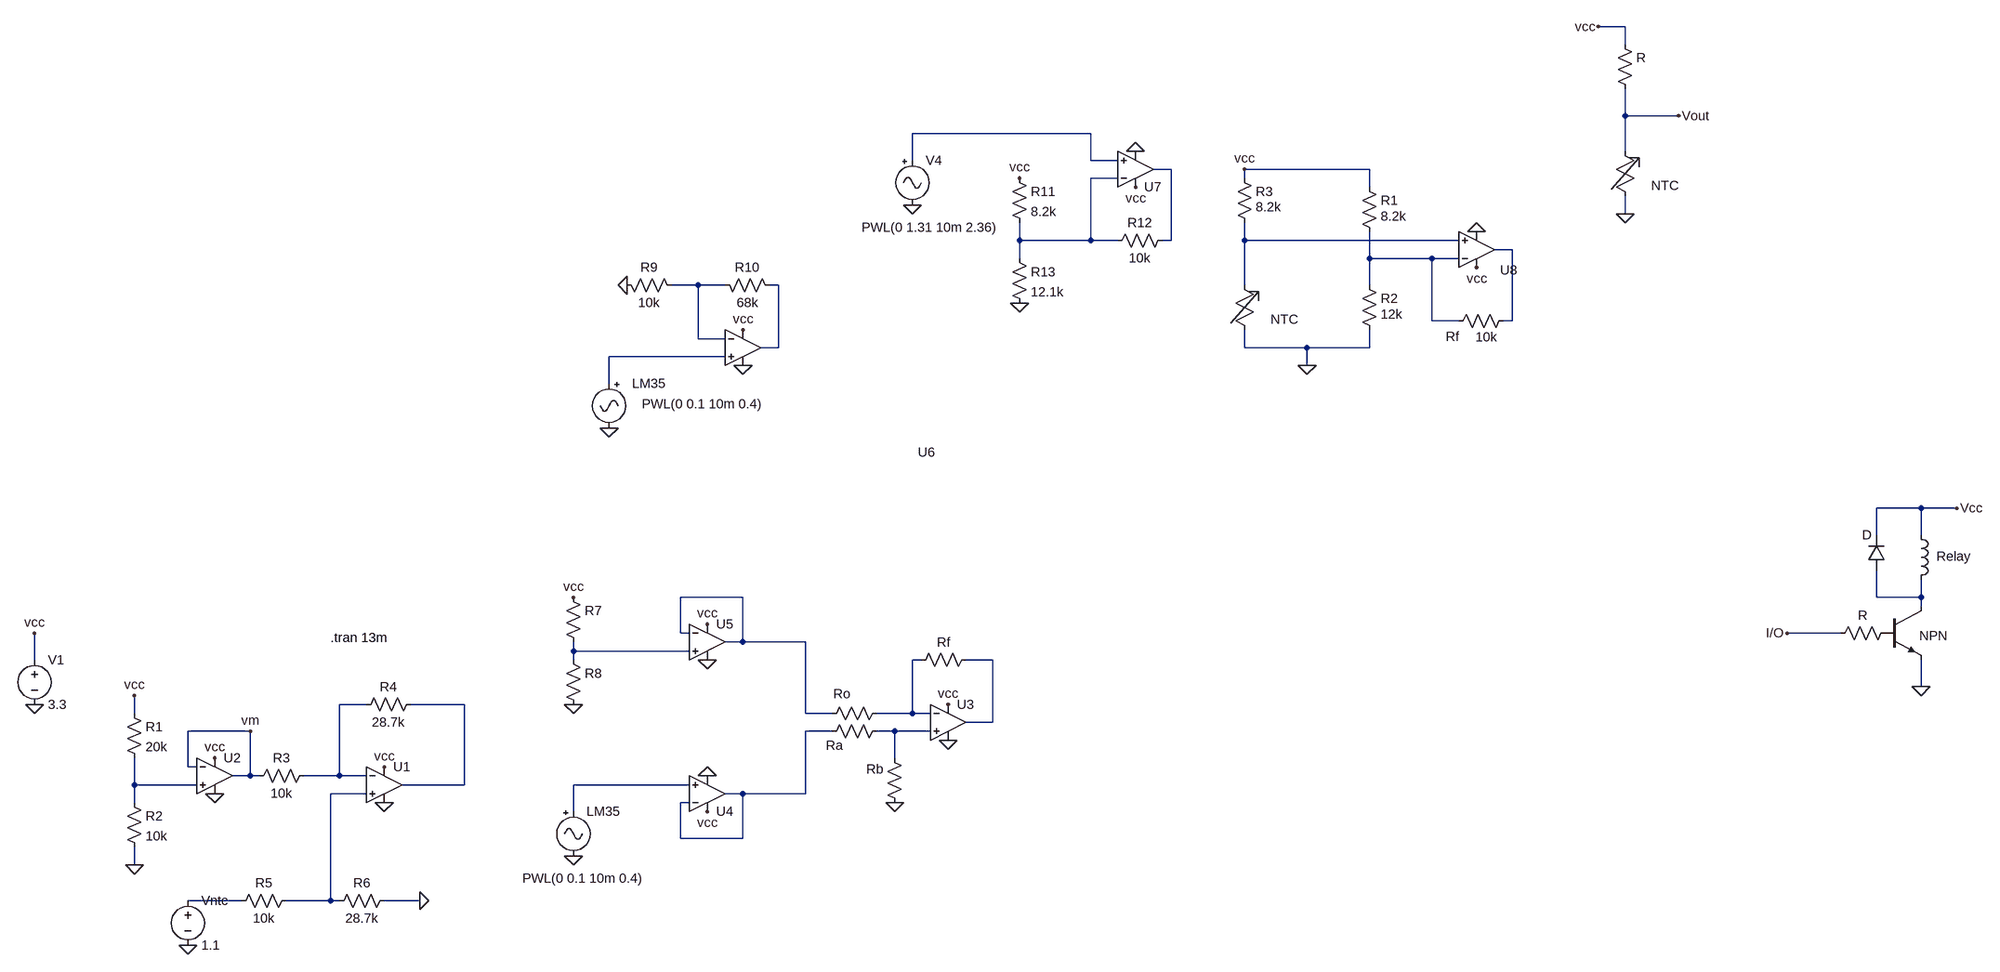
[diagram p0: schematic emst1.asc]
emst1.asc, the LTspice schematic file:
Version 4
SHEET 1 5656 680
WIRE 4752 -1024 4704 -1024
WIRE 4752 -992 4752 -1024
WIRE 4752 -864 4752 -912
WIRE 4848 -864 4752 -864
WIRE 2384 -832 2064 -832
WIRE 4752 -800 4752 -864
WIRE 2064 -784 2064 -832
WIRE 2384 -784 2384 -832
WIRE 2432 -784 2384 -784
WIRE 2528 -768 2496 -768
WIRE 3472 -768 3248 -768
WIRE 2432 -752 2384 -752
WIRE 3248 -752 3248 -768
WIRE 3472 -736 3472 -768
WIRE 4752 -688 4752 -720
WIRE 2256 -640 2256 -672
WIRE 2384 -640 2384 -752
WIRE 2384 -640 2256 -640
WIRE 2432 -640 2384 -640
WIRE 2528 -640 2528 -768
WIRE 2528 -640 2512 -640
WIRE 3248 -640 3248 -672
WIRE 3632 -640 3248 -640
WIRE 3728 -624 3696 -624
WIRE 2256 -608 2256 -640
WIRE 3472 -608 3472 -656
WIRE 3584 -608 3472 -608
WIRE 3632 -608 3584 -608
WIRE 1680 -560 1632 -560
WIRE 1728 -560 1680 -560
WIRE 1824 -560 1808 -560
WIRE 3248 -560 3248 -640
WIRE 3472 -560 3472 -608
WIRE 3584 -496 3584 -608
WIRE 3632 -496 3584 -496
WIRE 3728 -496 3728 -624
WIRE 3728 -496 3712 -496
WIRE 1680 -464 1680 -560
WIRE 1728 -464 1680 -464
WIRE 1824 -448 1824 -560
WIRE 1824 -448 1792 -448
WIRE 3248 -448 3248 -480
WIRE 3360 -448 3248 -448
WIRE 3472 -448 3472 -480
WIRE 3472 -448 3360 -448
WIRE 1728 -432 1520 -432
WIRE 3360 -416 3360 -448
WIRE 1520 -384 1520 -432
WIRE 5536 -160 5456 -160
WIRE 5600 -160 5536 -160
WIRE 5456 -112 5456 -160
WIRE 5536 -112 5536 -160
WIRE 1760 0 1648 0
WIRE 5456 0 5456 -48
WIRE 5536 0 5536 -32
WIRE 5536 0 5456 0
WIRE 5536 16 5536 0
WIRE 1648 64 1648 0
WIRE 1664 64 1648 64
WIRE 5392 64 5296 64
WIRE 1760 80 1760 0
WIRE 1760 80 1728 80
WIRE 1872 80 1760 80
WIRE 1456 96 1456 80
WIRE 1664 96 1456 96
WIRE 128 112 128 64
WIRE 1456 112 1456 96
WIRE 2080 112 2064 112
WIRE 2208 112 2160 112
WIRE 5536 160 5536 112
WIRE 768 192 720 192
WIRE 944 192 848 192
WIRE 352 208 352 176
WIRE 1872 208 1872 80
WIRE 1920 208 1872 208
WIRE 2064 208 2064 112
WIRE 2064 208 2000 208
WIRE 2096 208 2064 208
WIRE 2208 224 2208 112
WIRE 2208 224 2160 224
WIRE 560 240 448 240
WIRE 1920 240 1872 240
WIRE 2032 240 2000 240
WIRE 2096 240 2032 240
WIRE 2032 288 2032 240
WIRE 448 304 448 240
WIRE 464 304 448 304
WIRE 560 320 560 240
WIRE 560 320 528 320
WIRE 576 320 560 320
WIRE 720 320 720 192
WIRE 720 320 656 320
WIRE 768 320 720 320
WIRE 352 336 352 288
WIRE 464 336 352 336
WIRE 944 336 944 192
WIRE 944 336 832 336
WIRE 1664 336 1456 336
WIRE 768 352 704 352
WIRE 1760 352 1728 352
WIRE 1872 352 1872 240
WIRE 1872 352 1760 352
WIRE 352 368 352 336
WIRE 1664 368 1648 368
WIRE 1456 384 1456 336
WIRE 1648 432 1648 368
WIRE 1760 432 1760 352
WIRE 1760 432 1648 432
WIRE 352 480 352 448
WIRE 544 544 448 544
WIRE 704 544 704 352
WIRE 704 544 624 544
WIRE 720 544 704 544
WIRE 864 544 800 544
FLAG 800 368 0
FLAG 864 544 0
FLAG 352 480 0
FLAG 128 192 0
FLAG 128 64 vcc
FLAG 352 176 vcc
FLAG 800 304 vcc
FLAG 448 624 0
FLAG 496 288 vcc
FLAG 496 352 0
FLAG 2128 256 0
FLAG 2128 192 vcc
FLAG 560 240 vm
FLAG 1696 384 vcc
FLAG 1696 320 0
FLAG 1456 464 0
FLAG 2032 368 0
FLAG 1696 48 vcc
FLAG 1696 112 0
FLAG 1456 192 0
FLAG 1456 0 vcc
FLAG 1760 -480 vcc
FLAG 1760 -416 0
FLAG 1520 -304 0
FLAG 1552 -560 0
FLAG 2464 -736 vcc
FLAG 2464 -800 0
FLAG 2064 -704 0
FLAG 2256 -528 0
FLAG 2256 -752 vcc
FLAG 3664 -592 vcc
FLAG 3664 -656 0
FLAG 3360 -416 0
FLAG 3248 -768 vcc
FLAG 4704 -1024 vcc
FLAG 4752 -688 0
FLAG 4848 -864 Vout
FLAG 5536 160 0
FLAG 5600 -160 Vcc
FLAG 5296 64 I/O
SYMBOL Res 336 192 R0
SYMATTR InstName R1
SYMATTR Value 20k
SYMBOL Res 336 352 R0
SYMATTR InstName R2
SYMATTR Value 10k
SYMBOL Res 560 336 R270
WINDOW 0 32 56 VTop 2
WINDOW 3 0 56 VBottom 2
SYMATTR InstName R3
SYMATTR Value 10k
SYMBOL Res 752 208 R270
WINDOW 0 32 56 VTop 2
WINDOW 3 0 56 VBottom 2
SYMATTR InstName R4
SYMATTR Value 28.7k
SYMBOL Res 528 560 R270
WINDOW 0 32 56 VTop 2
WINDOW 3 0 56 VBottom 2
SYMATTR InstName R5
SYMATTR Value 10k
SYMBOL Res 816 528 R90
WINDOW 0 0 56 VBottom 2
WINDOW 3 32 56 VTop 2
SYMATTR InstName R6
SYMATTR Value 28.7k
SYMBOL UniversalOpAmp 800 336 R0
SYMATTR InstName U1
SYMBOL Voltage 128 96 R0
SYMATTR InstName V1
SYMATTR Value 3.3
SYMBOL Voltage 448 528 R0
SYMATTR InstName Vntc
SYMATTR Value 1.1
SYMBOL UniversalOpAmp 496 320 R0
SYMATTR InstName U2
SYMBOL UniversalOpAmp 2128 224 R0
SYMATTR InstName U3
SYMBOL res 2048 384 R180
WINDOW 0 36 76 Left 2
WINDOW 3 36 40 Left 2
SYMATTR InstName Rb
SYMATTR Value ""
SYMBOL res 2016 224 R90
WINDOW 0 57 92 VBottom 2
WINDOW 3 32 56 VTop 2
SYMATTR InstName Ra
SYMATTR Value ""
SYMBOL UniversalOpAmp 1696 352 M180
SYMATTR InstName U4
SYMBOL Misc\\signal 1456 368 R0
WINDOW 3 -91 136 Left 2
WINDOW 123 0 0 Left 0
WINDOW 39 0 0 Left 0
SYMATTR Value PWL(0 0.1 10m 0.4)
SYMATTR InstName LM35
SYMBOL res 2016 192 R90
WINDOW 0 -3 78 VBottom 2
WINDOW 3 -27 25 VTop 2
SYMATTR InstName Ro
SYMATTR Value ""
SYMBOL res 2176 96 R90
WINDOW 0 0 56 VBottom 2
WINDOW 3 32 56 VTop 2
SYMATTR InstName Rf
SYMATTR Value ""
SYMBOL UniversalOpAmp 1696 80 R0
SYMATTR InstName U5
SYMBOL res 1440 -16 R0
SYMATTR InstName R7
SYMATTR Value ""
SYMBOL res 1440 96 R0
SYMATTR InstName R8
SYMATTR Value ""
SYMBOL UniversalOpAmp 1760 -448 R0
WINDOW 0 314 188 Left 2
SYMATTR InstName U6
SYMBOL Misc\\signal 1520 -400 M0
WINDOW 3 -276 53 Left 2
WINDOW 123 0 0 Left 0
WINDOW 39 0 0 Left 0
WINDOW 0 -102 16 Left 2
SYMATTR Value PWL(0 0.1 10m 0.4)
SYMATTR InstName LM35
SYMBOL res 1648 -544 M270
WINDOW 0 32 56 VTop 2
WINDOW 3 0 56 VBottom 2
SYMATTR InstName R9
SYMATTR Value 10k
SYMBOL res 1824 -544 M270
WINDOW 0 32 56 VTop 2
WINDOW 3 0 56 VBottom 2
SYMATTR InstName R10
SYMATTR Value 68k
SYMBOL UniversalOpAmp 2464 -768 M180
SYMATTR InstName U7
SYMBOL Misc\\signal 2064 -800 R0
WINDOW 3 -91 136 Left 2
WINDOW 123 0 0 Left 0
WINDOW 39 0 0 Left 0
SYMATTR Value PWL(0 1.31 10m 2.36)
SYMATTR InstName V4
SYMBOL res 2528 -656 R90
WINDOW 0 0 56 VBottom 2
WINDOW 3 32 56 VTop 2
SYMATTR InstName R12
SYMATTR Value 10k
SYMBOL res 2240 -768 R0
SYMATTR InstName R11
SYMATTR Value 8.2k
SYMBOL res 2240 -624 R0
SYMATTR InstName R13
SYMATTR Value 12.1k
SYMBOL UniversalOpAmp 3664 -624 M180
WINDOW 0 42 -37 Left 2
SYMATTR InstName U8
SYMBOL res 3728 -512 R90
WINDOW 0 60 107 VBottom 2
WINDOW 3 61 46 VBottom 2
SYMATTR InstName Rf
SYMATTR Value 10k
SYMBOL res 3456 -752 R0
WINDOW 3 36 68 Left 2
SYMATTR InstName R1
SYMATTR Value 8.2k
SYMBOL res 3456 -576 R0
WINDOW 3 36 68 Left 2
SYMATTR InstName R2
SYMATTR Value 12k
SYMBOL VarRes 3232 -576 R0
SYMATTR InstName NTC
SYMATTR Value ""
SYMBOL res 3232 -768 R0
WINDOW 3 36 68 Left 2
SYMATTR InstName R3
SYMATTR Value 8.2k
SYMBOL VarRes 4736 -816 R0
SYMATTR InstName NTC
SYMATTR Value ""
SYMBOL res 4736 -1008 R0
SYMATTR InstName R
SYMATTR Value ""
SYMBOL res 5488 48 R90
WINDOW 0 0 56 VBottom 2
WINDOW 3 32 56 VTop 2
SYMATTR InstName R
SYMATTR Value ""
SYMBOL npn 5472 16 R0
WINDOW 0 61 53 Left 2
SYMATTR InstName NPN
SYMATTR Value ""
SYMBOL ind 5520 -128 R0
WINDOW 0 44 54 Left 2
SYMATTR InstName Relay
SYMATTR Value ""
SYMBOL diode 5472 -48 R180
WINDOW 0 24 64 Left 2
WINDOW 3 24 0 Left 2
SYMATTR InstName D
SYMATTR Value ""
TEXT 704 72 Left 2 !.tran 13m

The netlist it stands for:
* emst1.asc
R1 vcc N019 20k
R2 N019 0 10k
R3 vm N015 10k
R4 N015 N016 28.7k
R5 N022 N021 10k
R6 0 N021 28.7k
XU1 N021 N015 vcc 0 N016 level1 Avol=1Meg GBW=10Meg Vos=0 En=0 Enk=0 In=0 Ink=0 Rin=500Meg  ; pins In+ In- V+ V- OUT
V1 vcc 0 3.3
Vntc N022 0 1.1
XU2 N019 vm vcc 0 vm level1 Avol=1Meg GBW=10Meg Vos=0 En=0 Enk=0 In=0 Ink=0 Rin=500Meg  ; pins In+ In- V+ V- OUT
XU3 N018 N013 vcc 0 N014 level1 Avol=1Meg GBW=10Meg Vos=0 En=0 Enk=0 In=0 Ink=0 Rin=500Meg  ; pins In+ In- V+ V- OUT
Rb 0 N018
Ra N018 N017
XU4 N020 N017 vcc 0 N017 level1 Avol=1Meg GBW=10Meg Vos=0 En=0 Enk=0 In=0 Ink=0 Rin=500Meg  ; pins In+ In- V+ V- OUT
V§LM35 N020 0 PWL(0 0.1 10m 0.4)
Ro N013 N010
Rf N014 N013
XU5 N012 N010 vcc 0 N010 level1 Avol=1Meg GBW=10Meg Vos=0 En=0 Enk=0 In=0 Ink=0 Rin=500Meg  ; pins In+ In- V+ V- OUT
R7 vcc N012
R8 N012 0
XU6 N009 N007 vcc 0 N008 level1 Avol=1Meg GBW=10Meg Vos=0 En=0 Enk=0 In=0 Ink=0 Rin=500Meg  ; pins In+ In- V+ V- OUT
V§LM35 N009 0 PWL(0 0.1 10m 0.4)
R9 N007 0 10k
R10 N008 N007 68k
XU7 N001 N003 vcc 0 N002 level1 Avol=1Meg GBW=10Meg Vos=0 En=0 Enk=0 In=0 Ink=0 Rin=500Meg  ; pins In+ In- V+ V- OUT
V4 N001 0 PWL(0 1.31 10m 2.36)
R12 N002 N003 10k
R11 vcc N003 8.2k
R13 N003 0 12.1k
XU8 N004 N006 vcc 0 N005 level1 Avol=1Meg GBW=10Meg Vos=0 En=0 Enk=0 In=0 Ink=0 Rin=500Meg  ; pins In+ In- V+ V- OUT
Rf N005 N006 10k
R1 vcc N006 8.2k
R2 N006 0 12k
R§NTC N004 0
R3 vcc N004 8.2k
R§NTC Vout 0
R vcc Vout
R P001 I/O
Q§NPN N011 P001 0 0
L§Relay vcc N011
D N011 vcc
.model D D
.lib standard.dio
.model NPN NPN
.model PNP PNP
.lib standard.bjt
.tran 13m
.lib UniversalOpAmp1.lib
.backanno
.end